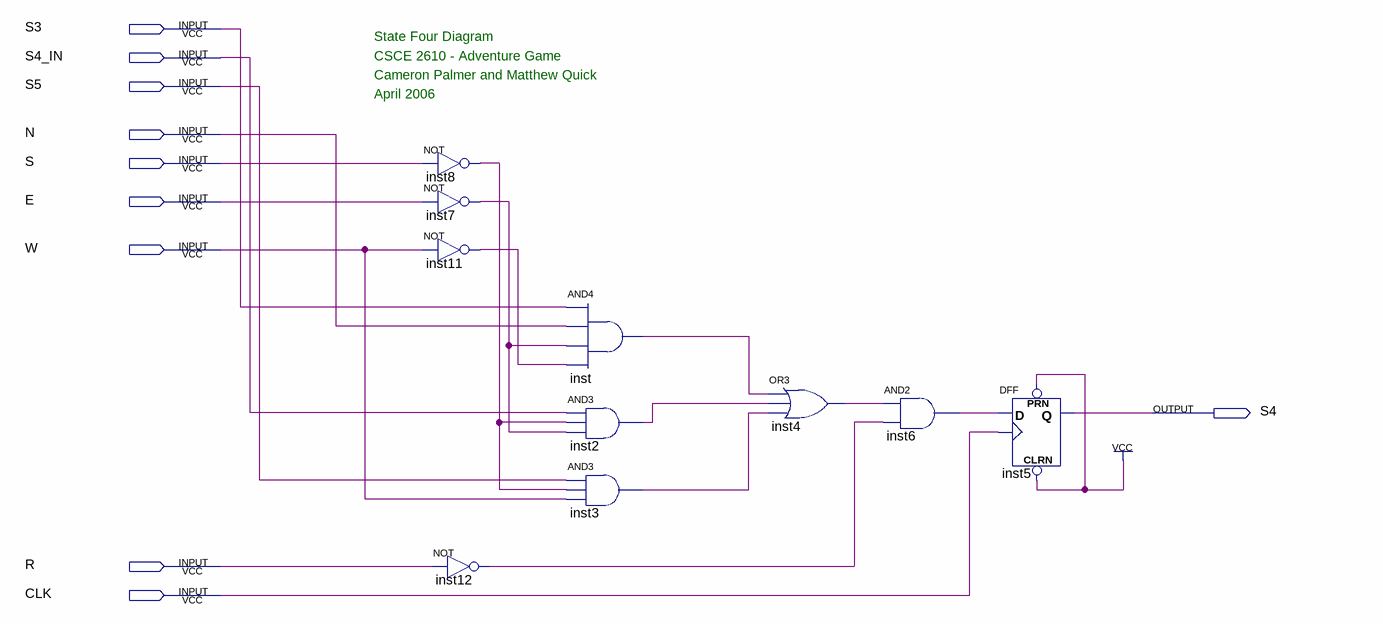
[diagram p0: schematic sheet]
// Quartus schematic state_four.bdf as structural Verilog: 10 symbols, 10 pins
module state_four (
  input  S3,
  input  S4_IN,
  input  S5,
  input  N,
  input  S,
  input  E,
  input  W,
  input  R,
  input  CLK,
  output S4
);

  wire inst2_out, inst3_out, inst4_out, inst6_out, inst7_out, inst8_out, inst11_out, inst12_out, inst_out;

  not inst8 (inst8_out, S);
  not inst7 (inst7_out, E);
  not inst11 (inst11_out, W);
  not inst12 (inst12_out, R);
  and inst (inst_out, S3, N, inst7_out, inst11_out);
  and inst2 (inst2_out, S4_IN, inst8_out, inst7_out);
  and inst3 (inst3_out, S5, inst8_out, W);
  or inst4 (inst4_out, inst_out, inst2_out, inst3_out);
  and inst6 (inst6_out, inst4_out, inst12_out);
  DFF inst5 (.CLRN(1'b1), .CLK(CLK), .D(inst6_out), .PRN(1'b1), .Q(S4));

  // Notes on the sheet:
  //   State Four Diagram
  //   CSCE 2610 - Adventure Game
  //   Cameron Palmer and Matthew Quick
  //   April 2006
endmodule
